# Altium schematic sheet Block_Diagram.SchDoc
size A; SheetNumber: 1; SheetTotal: 7
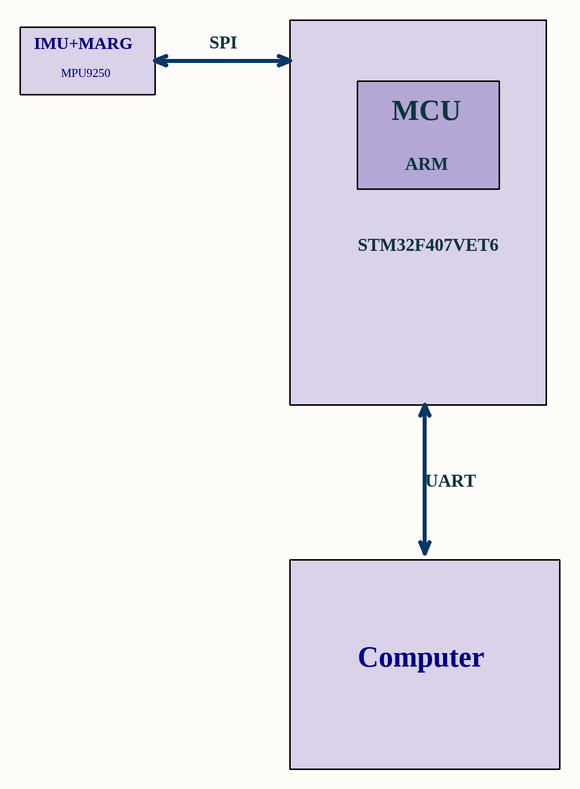
[diagram p0: Block_Diagram.SchDoc]

## Notes on the sheet
- IMU+MARG
- MPU9250
- SPI
- MCU
- ARM
- STM32F407VET6
- UART
- Computer